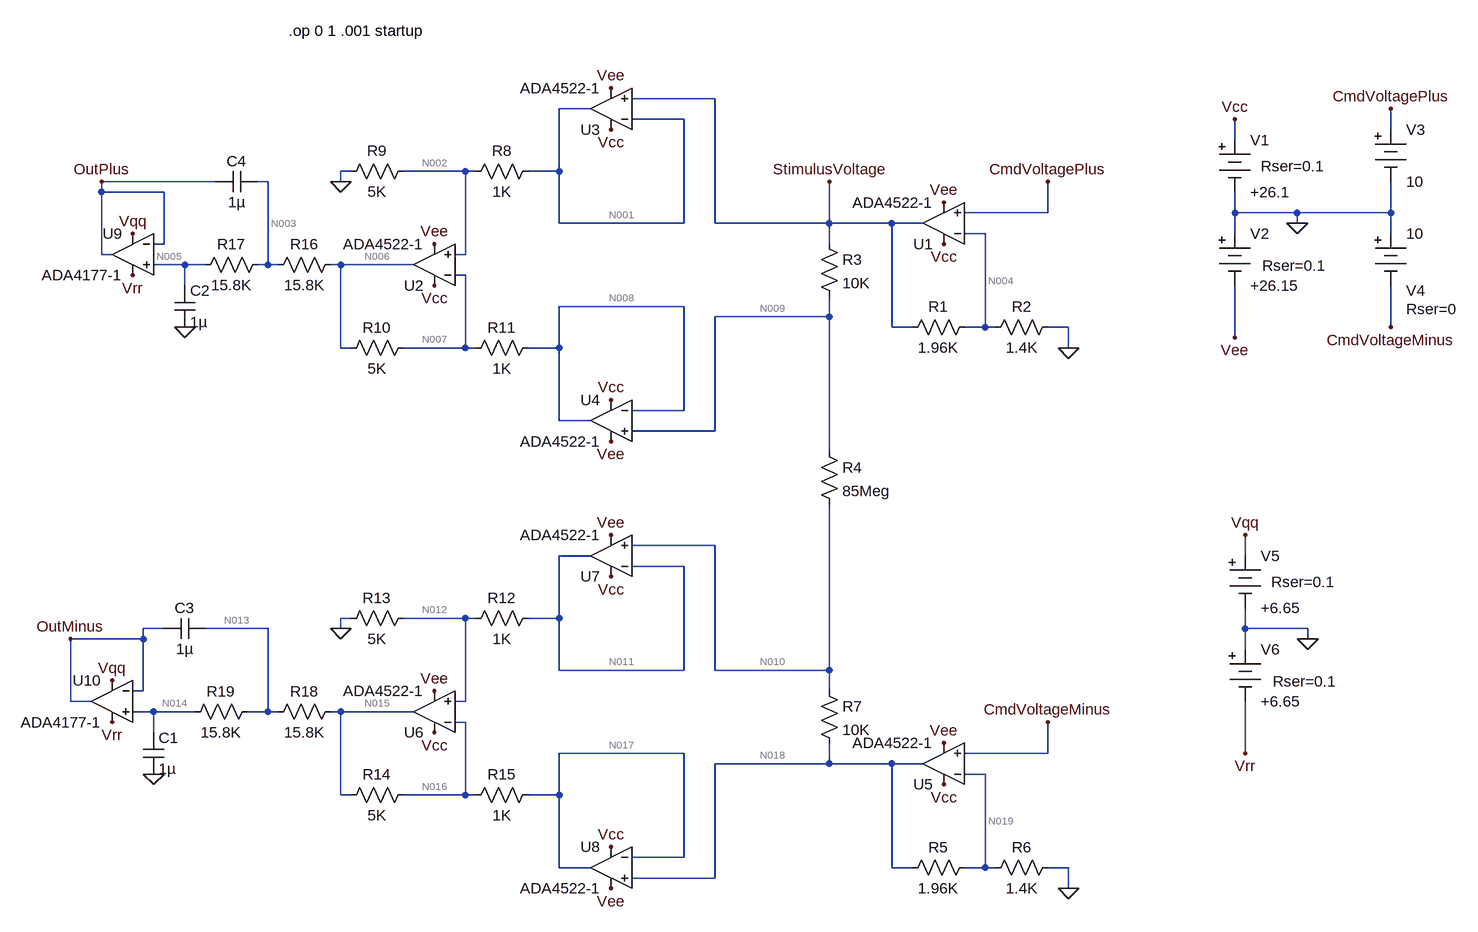
[diagram p0: schematic JukkaRev2_Model2A(020720).asc]
JukkaRev2_Model2A(020720).asc, the LTspice schematic file:
Version 4
SHEET 1 880 888
WIRE -560 -688 -688 -688
WIRE -752 -672 -800 -672
WIRE -608 -656 -688 -656
WIRE 480 -640 480 -672
WIRE 240 -624 240 -656
WIRE -1120 -576 -1136 -576
WIRE -944 -576 -1040 -576
WIRE -928 -576 -944 -576
WIRE -800 -576 -800 -672
WIRE -800 -576 -848 -576
WIRE -1328 -560 -1504 -560
WIRE -1248 -560 -1264 -560
WIRE -1136 -560 -1136 -576
WIRE -1504 -544 -1504 -560
WIRE -1408 -544 -1504 -544
WIRE -48 -512 -48 -560
WIRE -48 -512 -176 -512
WIRE 240 -512 240 -544
WIRE 336 -512 240 -512
WIRE 480 -512 480 -560
WIRE 480 -512 336 -512
WIRE -800 -496 -800 -576
WIRE -608 -496 -608 -656
WIRE -608 -496 -800 -496
WIRE -560 -496 -560 -688
WIRE -384 -496 -384 -560
WIRE -384 -496 -560 -496
WIRE -288 -496 -384 -496
WIRE -240 -496 -288 -496
WIRE 336 -496 336 -512
WIRE -144 -480 -176 -480
WIRE 240 -480 240 -512
WIRE 480 -480 480 -512
WIRE -1408 -464 -1408 -544
WIRE -1408 -464 -1424 -464
WIRE -384 -464 -384 -496
WIRE -1504 -448 -1504 -544
WIRE -1488 -448 -1504 -448
WIRE -944 -448 -944 -576
WIRE -944 -448 -960 -448
WIRE -1376 -432 -1424 -432
WIRE -1344 -432 -1376 -432
WIRE -1248 -432 -1248 -560
WIRE -1248 -432 -1264 -432
WIRE -1232 -432 -1248 -432
WIRE -1136 -432 -1152 -432
WIRE -1024 -432 -1136 -432
WIRE -944 -416 -960 -416
WIRE -1376 -400 -1376 -432
WIRE -608 -368 -800 -368
WIRE -384 -352 -384 -384
WIRE -384 -352 -560 -352
WIRE -288 -336 -288 -496
WIRE -256 -336 -288 -336
WIRE -144 -336 -144 -480
WIRE -144 -336 -176 -336
WIRE -128 -336 -144 -336
WIRE -16 -336 -48 -336
WIRE 480 -336 480 -400
WIRE 240 -320 240 -400
WIRE -1136 -304 -1136 -432
WIRE -1120 -304 -1136 -304
WIRE -944 -304 -944 -416
WIRE -944 -304 -1040 -304
WIRE -928 -304 -944 -304
WIRE -800 -304 -800 -368
WIRE -800 -304 -848 -304
WIRE -16 -304 -16 -336
WIRE -608 -208 -608 -368
WIRE -608 -208 -688 -208
WIRE -800 -192 -800 -304
WIRE -752 -192 -800 -192
WIRE -560 -176 -560 -352
WIRE -560 -176 -688 -176
WIRE -384 -144 -384 -352
WIRE -560 0 -688 0
WIRE -752 16 -800 16
WIRE 256 16 256 -16
WIRE -608 32 -688 32
WIRE -1120 112 -1136 112
WIRE -944 112 -1040 112
WIRE -928 112 -944 112
WIRE -800 112 -800 16
WIRE -800 112 -848 112
WIRE -1408 128 -1440 128
WIRE -1248 128 -1344 128
WIRE -1136 128 -1136 112
WIRE 256 128 256 96
WIRE 352 128 256 128
WIRE -1440 144 -1440 128
WIRE -1440 144 -1552 144
WIRE 352 144 352 128
WIRE 256 160 256 128
WIRE -800 192 -800 112
WIRE -608 192 -608 32
WIRE -608 192 -800 192
WIRE -560 192 -560 0
WIRE -384 192 -384 -64
WIRE -384 192 -560 192
WIRE -1440 224 -1440 144
WIRE -1440 224 -1456 224
WIRE -384 224 -384 192
WIRE -1552 240 -1552 144
WIRE -1520 240 -1552 240
WIRE -944 240 -944 112
WIRE -944 240 -960 240
WIRE -1424 256 -1456 256
WIRE -1360 256 -1424 256
WIRE -1248 256 -1248 128
WIRE -1248 256 -1280 256
WIRE -1232 256 -1248 256
WIRE -1136 256 -1152 256
WIRE -1024 256 -1136 256
WIRE -944 272 -960 272
WIRE -1424 288 -1424 256
WIRE -608 320 -800 320
WIRE -48 320 -48 272
WIRE -48 320 -176 320
WIRE 256 320 256 240
WIRE -384 336 -384 304
WIRE -384 336 -560 336
WIRE -288 336 -384 336
WIRE -240 336 -288 336
WIRE -144 352 -176 352
WIRE -1136 384 -1136 256
WIRE -1120 384 -1136 384
WIRE -944 384 -944 272
WIRE -944 384 -1040 384
WIRE -928 384 -944 384
WIRE -800 384 -800 320
WIRE -800 384 -848 384
WIRE -608 480 -608 320
WIRE -608 480 -688 480
WIRE -800 496 -800 384
WIRE -752 496 -800 496
WIRE -288 496 -288 336
WIRE -256 496 -288 496
WIRE -144 496 -144 352
WIRE -144 496 -176 496
WIRE -128 496 -144 496
WIRE -16 496 -48 496
WIRE -560 512 -560 336
WIRE -560 512 -688 512
WIRE -16 528 -16 496
FLAG 336 -496 0
FLAG 240 -656 Vcc
FLAG 240 -320 Vee
FLAG -208 -464 Vcc
FLAG -16 -304 0
FLAG 480 -672 CmdVoltagePlus
FLAG 480 -336 CmdVoltageMinus
FLAG -48 -560 CmdVoltagePlus
FLAG -384 -560 StimulusVoltage
FLAG -720 -704 Vee
FLAG -720 -640 Vcc
FLAG -208 -528 Vee
FLAG -720 -160 Vee
FLAG -720 -224 Vcc
FLAG -992 -400 Vcc
FLAG -992 -464 Vee
FLAG -1504 -560 OutPlus
FLAG -1136 -560 0
FLAG -208 368 Vcc
FLAG -16 528 0
FLAG -48 272 CmdVoltageMinus
FLAG -720 -16 Vee
FLAG -720 48 Vcc
FLAG -208 304 Vee
FLAG -720 528 Vee
FLAG -720 464 Vcc
FLAG -992 288 Vcc
FLAG -992 224 Vee
FLAG -1552 144 OutMinus
FLAG -1136 128 0
FLAG -1456 -416 Vrr
FLAG -1488 272 Vrr
FLAG -1456 -480 Vqq
FLAG -1488 208 Vqq
FLAG -1376 -336 0
FLAG -1424 352 0
FLAG 352 144 0
FLAG 256 -16 Vqq
FLAG 256 320 Vrr
SYMBOL Misc\\battery 240 -640 R0
WINDOW 123 0 0 Left 0
WINDOW 39 40 56 Left 2
SYMATTR SpiceLine Rser=0.1
SYMATTR InstName V1
SYMATTR Value +26.1
SYMBOL Misc\\battery 240 -496 R0
WINDOW 123 0 0 Left 0
WINDOW 39 42 65 Left 2
SYMATTR SpiceLine Rser=0.1
SYMATTR InstName V2
SYMATTR Value +26.15
SYMBOL res -160 -352 R90
WINDOW 0 0 56 VBottom 2
WINDOW 3 32 56 VTop 2
SYMATTR InstName R1
SYMATTR Value 1.96K
SYMBOL res -32 -352 R90
WINDOW 0 0 56 VBottom 2
WINDOW 3 32 56 VTop 2
SYMATTR InstName R2
SYMATTR Value 1.4K
SYMBOL Misc\\battery 480 -656 R0
WINDOW 123 0 0 Left 0
WINDOW 39 0 0 Left 0
SYMATTR InstName V3
SYMATTR Value 10
SYMBOL Misc\\battery 480 -496 R0
WINDOW 0 24 104 Left 2
WINDOW 3 24 16 Left 2
WINDOW 123 0 0 Left 0
WINDOW 39 24 132 Left 2
SYMATTR InstName V4
SYMATTR Value 10
SYMATTR SpiceLine Rser=0
SYMBOL res -400 -480 R0
SYMATTR InstName R3
SYMATTR Value 10K
SYMBOL res -400 -160 R0
SYMATTR InstName R4
SYMATTR Value 85Meg
SYMBOL res -832 -592 R90
WINDOW 0 0 56 VBottom 2
WINDOW 3 32 56 VTop 2
SYMATTR InstName R8
SYMATTR Value 1K
SYMBOL res -1024 -592 R90
WINDOW 0 0 56 VBottom 2
WINDOW 3 32 56 VTop 2
SYMATTR InstName R9
SYMATTR Value 5K
SYMBOL res -1024 -320 R90
WINDOW 0 0 56 VBottom 2
WINDOW 3 32 56 VTop 2
SYMATTR InstName R10
SYMATTR Value 5K
SYMBOL res -832 -320 R90
WINDOW 0 0 56 VBottom 2
WINDOW 3 32 56 VTop 2
SYMATTR InstName R11
SYMATTR Value 1K
SYMBOL Opamps\\ADA4522-1 -208 -432 R180
SYMATTR InstName U1
SYMBOL Opamps\\ADA4522-1 -992 -368 R180
SYMATTR InstName U2
SYMBOL Opamps\\ADA4522-1 -720 -608 R180
SYMATTR InstName U3
SYMBOL Opamps\\ADA4522-1 -720 -256 M0
SYMATTR InstName U4
SYMBOL res -160 480 R90
WINDOW 0 0 56 VBottom 2
WINDOW 3 32 56 VTop 2
SYMATTR InstName R5
SYMATTR Value 1.96K
SYMBOL res -32 480 R90
WINDOW 0 0 56 VBottom 2
WINDOW 3 32 56 VTop 2
SYMATTR InstName R6
SYMATTR Value 1.4K
SYMBOL res -400 208 R0
SYMATTR InstName R7
SYMATTR Value 10K
SYMBOL res -832 96 R90
WINDOW 0 0 56 VBottom 2
WINDOW 3 32 56 VTop 2
SYMATTR InstName R12
SYMATTR Value 1K
SYMBOL res -1024 96 R90
WINDOW 0 0 56 VBottom 2
WINDOW 3 32 56 VTop 2
SYMATTR InstName R13
SYMATTR Value 5K
SYMBOL res -1024 368 R90
WINDOW 0 0 56 VBottom 2
WINDOW 3 32 56 VTop 2
SYMATTR InstName R14
SYMATTR Value 5K
SYMBOL res -832 368 R90
WINDOW 0 0 56 VBottom 2
WINDOW 3 32 56 VTop 2
SYMATTR InstName R15
SYMATTR Value 1K
SYMBOL Opamps\\ADA4522-1 -208 400 R180
SYMATTR InstName U5
SYMBOL Opamps\\ADA4522-1 -992 320 R180
SYMATTR InstName U6
SYMBOL Opamps\\ADA4522-1 -720 80 R180
SYMATTR InstName U7
SYMBOL Opamps\\ADA4522-1 -720 432 M0
SYMATTR InstName U8
SYMBOL Opamps\\ADA4177-1 -1456 -448 M0
SYMATTR InstName U9
SYMBOL Opamps\\ADA4177-1 -1488 240 M0
SYMATTR InstName U10
SYMBOL res -1136 -448 R90
WINDOW 0 0 56 VBottom 2
WINDOW 3 32 56 VTop 2
SYMATTR InstName R16
SYMATTR Value 15.8K
SYMBOL res -1248 -448 R90
WINDOW 0 0 56 VBottom 2
WINDOW 3 32 56 VTop 2
SYMATTR InstName R17
SYMATTR Value 15.8K
SYMBOL res -1136 240 R90
WINDOW 0 0 56 VBottom 2
WINDOW 3 32 56 VTop 2
SYMATTR InstName R18
SYMATTR Value 15.8K
SYMBOL res -1264 240 R90
WINDOW 0 0 56 VBottom 2
WINDOW 3 32 56 VTop 2
SYMATTR InstName R19
SYMATTR Value 15.8K
SYMBOL cap -1440 288 R0
SYMATTR InstName C1
SYMATTR Value 1µ
SYMBOL cap -1392 -400 R0
SYMATTR InstName C2
SYMATTR Value 1µ
SYMBOL cap -1344 112 R90
WINDOW 0 0 32 VBottom 2
WINDOW 3 32 32 VTop 2
SYMATTR InstName C3
SYMATTR Value 1µ
SYMBOL cap -1264 -576 R90
WINDOW 0 0 32 VBottom 2
WINDOW 3 32 32 VTop 2
SYMATTR InstName C4
SYMATTR Value 1µ
SYMBOL Misc\\battery 256 0 R0
WINDOW 123 0 0 Left 0
WINDOW 39 40 56 Left 2
SYMATTR SpiceLine Rser=0.1
SYMATTR InstName V5
SYMATTR Value +6.65
SYMBOL Misc\\battery 256 144 R0
WINDOW 123 0 0 Left 0
WINDOW 39 42 65 Left 2
SYMATTR SpiceLine Rser=0.1
SYMATTR InstName V6
SYMATTR Value +6.65
TEXT -1216 -792 Left 2 !.op 0 1 .001 startup

The netlist it stands for:
* JukkaRev2_Model2A(020720).asc
V1 Vcc 0 +26.1 Rser=0.1
V2 0 Vee +26.15 Rser=0.1
R1 N004 StimulusVoltage 1.96K
R2 0 N004 1.4K
V3 CmdVoltagePlus 0 10
V4 0 CmdVoltageMinus 10 Rser=0
R3 StimulusVoltage N009 10K
R4 N009 N010 85Meg
R8 N001 N002 1K
R9 N002 0 5K
R10 N007 N006 5K
R11 N008 N007 1K
XU1 CmdVoltagePlus N004 Vcc Vee StimulusVoltage ADA4522-1  ; pins In+ In- V+ V- OUT
XU2 N002 N007 Vcc Vee N006 ADA4522-1  ; pins In+ In- V+ V- OUT
XU3 StimulusVoltage N001 Vcc Vee N001 ADA4522-1  ; pins In+ In- V+ V- OUT
XU4 N009 N008 Vcc Vee N008 ADA4522-1  ; pins In+ In- V+ V- OUT
R5 N019 N018 1.96K
R6 0 N019 1.4K
R7 N010 N018 10K
R12 N011 N012 1K
R13 N012 0 5K
R14 N016 N015 5K
R15 N017 N016 1K
XU5 CmdVoltageMinus N019 Vcc Vee N018 ADA4522-1  ; pins In+ In- V+ V- OUT
XU6 N012 N016 Vcc Vee N015 ADA4522-1  ; pins In+ In- V+ V- OUT
XU7 N010 N011 Vcc Vee N011 ADA4522-1  ; pins In+ In- V+ V- OUT
XU8 N018 N017 Vcc Vee N017 ADA4522-1  ; pins In+ In- V+ V- OUT
* U9: ADA4177-1 (symbol Opamps\ADA4177-1 not available, pins judged from their places): In+=N005 In-=OutPlus V+=Vqq V-=Vrr OUT=OutPlus
* U10: ADA4177-1 (symbol Opamps\ADA4177-1 not available, pins judged from their places): In+=N014 In-=OutMinus V+=Vqq V-=Vrr OUT=OutMinus
R16 N006 N003 15.8K
R17 N003 N005 15.8K
R18 N015 N013 15.8K
R19 N013 N014 15.8K
C1 N014 0 1µ
C2 N005 0 1µ
C3 N013 OutMinus 1µ
C4 N003 OutPlus 1µ
V5 Vqq 0 +6.65 Rser=0.1
V6 0 Vrr +6.65 Rser=0.1
.op 0 1 .001 startup
.backanno
.end

* Results of the author's LTspice run, read from the files saved beside the schematic
* Operating Point:
*   V(vcc) = 26.1 V
*   V(vee) = -26.15 V
*   V(n004) = 10 V
*   V(stimulusvoltage) = 24 V
*   V(cmdvoltageplus) = 10 V
*   V(cmdvoltageminus) = -10 V
*   V(n009) = 23.99 V
*   V(n010) = -23.99 V
*   V(n001) = 24 V
*   V(n002) = 20 V
*   V(n007) = 20 V
*   V(n006) = 28.01 mV
*   V(n008) = 23.99 V
*   V(n019) = -10 V
*   V(n018) = -24 V
*   V(n011) = -23.99 V
*   V(n012) = -20 V
*   V(n016) = -20 V
*   V(n015) = 28.66 mV
*   V(n017) = -24 V
*   V(vqq) = 6.65 V
*   V(vrr) = -6.65 V
*   V(outplus) = 28.03 mV
*   V(n005) = 28.03 mV
*   V(outminus) = 28.67 mV
*   V(n014) = 28.67 mV
*   V(n003) = 28.02 mV
*   V(n013) = 28.67 mV
*   I(C4) = 0 A
*   I(C3) = 0 A
*   I(C2) = 0 A
*   I(C1) = 0 A
*   I(R19) = -373 pA
*   I(R18) = -367.9 pA
*   I(R17) = -372.4 pA
*   I(R16) = -367.8 pA
*   I(R15) = -4.005 mA
*   I(R14) = -4.005 mA
*   I(R13) = -3.999 mA
*   I(R12) = -3.999 mA
*   I(R7) = 566.9 nA
*   I(R6) = 7.143 mA
*   I(R5) = 7.143 mA
*   I(R11) = 3.994 mA
*   I(R10) = 3.994 mA
*   I(R9) = 4 mA
*   I(R8) = 4 mA
*   I(R4) = 564.6 nA
*   I(R3) = 566.8 nA
*   I(R2) = -7.143 mA
*   I(R1) = -7.143 mA
*   I(V6) = -1 mA
*   I(V5) = -1 mA
*   I(V4) = -1.118 nA
*   I(V3) = -968.4 pA
*   I(V2) = -20.84 mA
*   I(V1) = -20.84 mA
* From the log:
*   Semiconductor Device Operating Points:
*                           --- Diodes ---
*   Name:   d:u10:11    d:u10:10     d:u10:9     d:u10:4     d:u10:7
*   Model:   u10:io      u10:din    u10:ovp2    u10:ovp2    u10:ovp1
*   Id:     -1.29e-19    2.38e-24   -1.67e-11   -1.66e-11   -1.67e-11
*   Vd:     -1.28e-07    2.38e-12   -6.68e+00   -6.62e+00   -6.68e+00
*   Req:     1.00e-12    1.00e-12    2.50e-12    2.50e-12    2.50e-12
*   CAP:     0.00e+00    0.00e+00    0.00e+00    0.00e+00    0.00e+00
*   Name:    d:u10:2     d:u10:1     d:u10:8     d:u10:6     d:u10:5
*   Model:  u10:ovp1     u10:1na     u10:1na      u10:x       u10:x
*   Id:     -1.66e-11    4.00e-10    4.00e-10   -6.68e-09   -6.62e-09
*   Vd:     -6.62e+00    6.62e+00    6.62e+00   -6.68e+00   -6.62e+00
*   Req:     2.50e-12    8.00e-10    8.00e-10    1.00e-09    1.00e-09
*   CAP:     0.00e+00    0.00e+00    0.00e+00    0.00e+00    0.00e+00
*   Name:    d:u9:11     d:u9:10     d:u9:9      d:u9:4      d:u9:7
*   Model:    u9:io      u9:din      u9:ovp2     u9:ovp2     u9:ovp1
*   Id:     -1.29e-19    2.29e-24   -1.67e-11   -1.66e-11   -1.67e-11
*   Vd:     -1.29e-07    2.29e-12   -6.68e+00   -6.62e+00   -6.68e+00
*   Req:     1.00e-12    1.00e-12    2.50e-12    2.50e-12    2.50e-12
*   CAP:     0.00e+00    0.00e+00    0.00e+00    0.00e+00    0.00e+00
*   Name:    d:u9:2      d:u9:1      d:u9:8      d:u9:6      d:u9:5
*   Model:   u9:ovp1     u9:1na      u9:1na       u9:x        u9:x
*   Id:     -1.66e-11    4.00e-10    4.00e-10   -6.68e-09   -6.62e-09
*   Vd:     -6.62e+00    6.62e+00    6.62e+00   -6.68e+00   -6.62e+00
*   Req:     2.50e-12    8.00e-10    8.00e-10    1.00e-09    1.00e-09
*   CAP:     0.00e+00    0.00e+00    0.00e+00    0.00e+00    0.00e+00
*   Name:    d:u8:7      d:u8:5      d:u8:1      d:u8:10     d:u8:9
*   Model:  u8:dbias    u8:dbias   u8:dantisat   u8:din     u8:dburn
*   Id:      1.01e-10    1.01e-10    2.26e-10    2.20e-09    2.12e-04
*   Vd:      5.01e+01    5.01e+01    6.79e-03    6.59e-05    5.22e+01
*   Req:     1.00e-08    1.00e-08    3.33e-08    3.33e-05    1.00e-02
*   CAP:     0.00e+00    0.00e+00    0.00e+00    0.00e+00    0.00e+00
*   Name:    d:u8:4      d:u8:3      d:u8:2      d:u8:6      d:u7:7
*   Model:    u8:dx       u8:dx       u8:dx       u8:dx     u7:dbias
*   Id:     -2.17e-12   -5.01e-11   -5.01e-11   -2.17e-12    1.01e-10
*   Vd:     -2.15e+00   -5.01e+01   -5.01e+01   -2.15e+00    5.01e+01
*   Req:     1.00e+12    1.00e+12    1.00e+12    1.00e+12    1.00e-08
*   CAP:     0.00e+00    0.00e+00    0.00e+00    0.00e+00    0.00e+00
*   Name:    d:u7:5      d:u7:1      d:u7:10     d:u7:9      d:u7:4
*   Model:  u7:dbias   u7:dantisat   u7:din     u7:dburn      u7:dx
*   Id:      1.01e-10    2.26e-10    2.20e-09    2.12e-04   -2.17e-12
*   Vd:      5.01e+01    6.78e-03    6.59e-05    5.22e+01   -2.15e+00
*   Req:     1.00e-08    3.33e-08    3.33e-05    1.00e-02    1.00e+12
*   CAP:     0.00e+00    0.00e+00    0.00e+00    0.00e+00    0.00e+00
*   Name:    d:u7:3      d:u7:2      d:u7:6      d:u6:7      d:u6:5
*   Model:    u7:dx       u7:dx       u7:dx     u6:dbias    u6:dbias
*   Id:     -5.01e-11   -5.01e-11   -2.17e-12    1.01e-10    1.01e-10
*   Vd:     -5.01e+01   -5.01e+01   -2.15e+00    4.61e+01    4.61e+01
*   Req:     1.00e+12    1.00e+12    1.00e+12    1.00e-08    1.00e-08
*   CAP:     0.00e+00    0.00e+00    0.00e+00    0.00e+00    0.00e+00
*   Name:    d:u6:1      d:u6:10     d:u6:9      d:u6:4      d:u6:3
*   Model: u6:dantisat   u6:din     u6:dburn      u6:dx       u6:dx
*   Id:     -4.06e-10    1.67e-09    2.12e-04   -6.15e-12   -4.61e-11
*   Vd:     -1.22e-02    5.00e-05    5.22e+01   -6.15e+00   -4.61e+01
*   Req:     3.33e-08    3.33e-05    1.00e-02    1.00e+12    1.00e+12
*   CAP:     0.00e+00    0.00e+00    0.00e+00    0.00e+00    0.00e+00
*   Name:    d:u6:2      d:u6:6      d:u5:7      d:u5:5      d:u5:1
*   Model:    u6:dx       u6:dx     u5:dbias    u5:dbias   u5:dantisat
*   Id:     -4.61e-11   -6.15e-12    1.01e-10    1.01e-10    3.71e-10
*   Vd:     -4.61e+01   -6.15e+00    3.61e+01    3.61e+01    1.11e-02
*   Req:     1.00e+12    1.00e+12    1.00e-08    1.00e-08    3.33e-08
*   CAP:     0.00e+00    0.00e+00    0.00e+00    0.00e+00    0.00e+00
*   Name:    d:u5:10     d:u5:9      d:u5:4      d:u5:3      d:u5:2
*   Model:   u5:din     u5:dburn      u5:dx       u5:dx       u5:dx
*   Id:      9.97e-10    2.12e-04   -1.62e-11   -3.61e-11   -3.61e-11
*   Vd:      2.99e-05    5.22e+01   -1.61e+01   -3.61e+01   -3.61e+01
*   Req:     3.33e-05    1.00e-02    1.00e+12    1.00e+12    1.00e+12
*   CAP:     0.00e+00    0.00e+00    0.00e+00    0.00e+00    0.00e+00
*   Name:    d:u5:6      d:u4:7      d:u4:5      d:u4:1      d:u4:10
*   Model:    u5:dx     u4:dbias    u4:dbias   u4:dantisat   u4:din
*   Id:     -1.62e-11    1.01e-10    1.01e-10   -4.06e-10   -2.23e-09
*   Vd:     -1.61e+01    2.10e+00    2.10e+00   -1.22e-02   -6.70e-05
*   Req:     1.00e+12    1.00e-08    1.00e-08    3.33e-08    3.33e-05
*   CAP:     0.00e+00    0.00e+00    0.00e+00    0.00e+00    0.00e+00
*   Name:    d:u4:9      d:u4:4      d:u4:3      d:u4:2      d:u4:6
*   Model:  u4:dburn      u4:dx       u4:dx       u4:dx       u4:dx
*   Id:      2.12e-04   -5.02e-11   -2.10e-12   -2.10e-12   -5.02e-11
*   Vd:      5.22e+01   -5.01e+01   -2.10e+00   -2.10e+00   -5.01e+01
*   Req:     1.00e-02    1.00e+12    1.00e+12    1.00e+12    1.00e+12
*   CAP:     0.00e+00    0.00e+00    0.00e+00    0.00e+00    0.00e+00
*   Name:    d:u3:7      d:u3:5      d:u3:1      d:u3:10     d:u3:9
*   Model:  u3:dbias    u3:dbias   u3:dantisat   u3:din     u3:dburn
*   Id:      1.01e-10    1.01e-10   -4.06e-10   -2.23e-09    2.12e-04
*   Vd:      2.10e+00    2.10e+00   -1.22e-02   -6.70e-05    5.22e+01
*   Req:     1.00e-08    1.00e-08    3.33e-08    3.33e-05    1.00e-02
*   CAP:     0.00e+00    0.00e+00    0.00e+00    0.00e+00    0.00e+00
*   Name:    d:u3:4      d:u3:3      d:u3:2      d:u3:6      d:u2:7
*   Model:    u3:dx       u3:dx       u3:dx       u3:dx     u2:dbias
*   Id:     -5.02e-11   -2.10e-12   -2.10e-12   -5.02e-11    1.01e-10
*   Vd:     -5.01e+01   -2.10e+00   -2.10e+00   -5.01e+01    6.10e+00
*   Req:     1.00e+12    1.00e+12    1.00e+12    1.00e+12    1.00e-08
*   CAP:     0.00e+00    0.00e+00    0.00e+00    0.00e+00    0.00e+00
*   Name:    d:u2:5      d:u2:1      d:u2:10     d:u2:9      d:u2:4
*   Model:  u2:dbias   u2:dantisat   u2:din     u2:dburn      u2:dx
*   Id:      1.01e-10    2.26e-10   -1.70e-09    2.12e-04   -4.61e-11
*   Vd:      6.10e+00    6.77e-03   -5.11e-05    5.22e+01   -4.61e+01
*   Req:     1.00e-08    3.33e-08    3.33e-05    1.00e-02    1.00e+12
*   CAP:     0.00e+00    0.00e+00    0.00e+00    0.00e+00    0.00e+00
*   Name:    d:u2:3      d:u2:2      d:u2:6      d:u1:7      d:u1:5
*   Model:    u2:dx       u2:dx       u2:dx     u1:dbias    u1:dbias
*   Id:     -6.11e-12   -6.11e-12   -4.61e-11    1.01e-10    1.01e-10
*   Vd:     -6.10e+00   -6.10e+00   -4.61e+01    1.61e+01    1.61e+01
*   Req:     1.00e+12    1.00e+12    1.00e+12    1.00e-08    1.00e-08
*   CAP:     0.00e+00    0.00e+00    0.00e+00    0.00e+00    0.00e+00
*   Name:    d:u1:1      d:u1:10     d:u1:9      d:u1:4      d:u1:3
*   Model: u1:dantisat   u1:din     u1:dburn      u1:dx       u1:dx
*   Id:     -6.12e-10   -1.05e-09    2.12e-04   -3.62e-11   -1.61e-11
*   Vd:     -1.84e-02   -3.15e-05    5.22e+01   -3.61e+01   -1.61e+01
*   Req:     3.33e-08    3.33e-05    1.00e-02    1.00e+12    1.00e+12
*   CAP:     0.00e+00    0.00e+00    0.00e+00    0.00e+00    0.00e+00
*   Name:    d:u1:2      d:u1:6
*   Model:    u1:dx       u1:dx
*   Id:     -1.61e-11   -3.62e-11
*   Vd:     -1.61e+01   -3.61e+01
*   Req:     1.00e+12    1.00e+12
*   CAP:     0.00e+00    0.00e+00
*                           --- VDMOSFET Transistors ---
*   Name:        m:u8:6      m:u8:5      m:u7:6      m:u7:5      m:u6:6
*   Model:       u8:noxn     u8:poxn     u7:noxn     u7:poxn     u6:noxn
*   Id:          4.01e-03   -5.01e-11    4.00e-03   -5.01e-11    2.62e-11
*   Vgs:         1.22e+00   -8.10e-01    1.22e+00   -8.11e-01    6.48e-01
*   Vds:         2.15e+00   -5.01e+01    2.15e+00   -5.01e+01    2.62e+01
*   Vth:         8.30e-01   -8.30e-01    8.30e-01   -8.30e-01    8.30e-01
*   Gm:          2.07e-02    0.00e+00    2.07e-02    0.00e+00    0.00e+00
*   Gds:         0.00e+00    0.00e+00    0.00e+00    0.00e+00    0.00e+00
*   Cgs:         0.00e+00    0.00e+00    0.00e+00    0.00e+00    0.00e+00
*   Cgd:         0.00e+00    0.00e+00    0.00e+00    0.00e+00    0.00e+00
*   Cbody:       0.00e+00    0.00e+00    0.00e+00    0.00e+00    0.00e+00
*   Name:        m:u6:5      m:u5:6      m:u5:5      m:u4:6      m:u4:5
*   Model:       u6:poxn     u5:noxn     u5:poxn     u4:noxn     u4:poxn
*   Id:         -4.00e-03    7.14e-03   -5.01e-11    5.02e-11   -3.99e-03
*   Vgs:        -1.38e+00    1.35e+00   -6.80e-01    6.49e-01   -1.38e+00
*   Vds:        -2.61e+01    2.15e+00   -5.01e+01    5.01e+01   -2.10e+00
*   Vth:        -8.30e-01    8.30e-01   -8.30e-01    8.30e-01   -8.30e-01
*   Gm:          1.45e-02    2.76e-02    0.00e+00    0.00e+00    1.45e-02
*   Gds:         0.00e+00    0.00e+00    0.00e+00    0.00e+00    0.00e+00
*   Cgs:         0.00e+00    0.00e+00    0.00e+00    0.00e+00    0.00e+00
*   Cgd:         0.00e+00    0.00e+00    0.00e+00    0.00e+00    0.00e+00
*   Cbody:       0.00e+00    0.00e+00    0.00e+00    0.00e+00    0.00e+00
*   Name:        m:u3:6      m:u3:5      m:u2:6      m:u2:5      m:u1:6
*   Model:       u3:noxn     u3:poxn     u2:noxn     u2:poxn     u1:noxn
*   Id:          5.02e-11   -4.00e-03    3.99e-03   -2.61e-11    5.02e-11
*   Vgs:         6.49e-01   -1.38e+00    1.22e+00   -8.11e-01    4.63e-01
*   Vds:         5.01e+01   -2.10e+00    2.62e+01   -2.61e+01    5.01e+01
*   Vth:         8.30e-01   -8.30e-01    8.30e-01   -8.30e-01    8.30e-01
*   Gm:          0.00e+00    1.45e-02    2.06e-02    0.00e+00    0.00e+00
*   Gds:         0.00e+00    0.00e+00    0.00e+00    0.00e+00    0.00e+00
*   Cgs:         0.00e+00    0.00e+00    0.00e+00    0.00e+00    0.00e+00
*   Cgd:         0.00e+00    0.00e+00    0.00e+00    0.00e+00    0.00e+00
*   Cbody:       0.00e+00    0.00e+00    0.00e+00    0.00e+00    0.00e+00
*   Name:        m:u1:5
*   Model:       u1:poxn
*   Id:         -7.14e-03
*   Vgs:        -1.56e+00
*   Vds:        -2.10e+00
*   Vth:        -8.30e-01
*   Gm:          1.94e-02
*   Gds:         0.00e+00
*   Cgs:         0.00e+00
*   Cgd:         0.00e+00
*   Cbody:       0.00e+00